# Altium schematic sheet M-LVDS_PHY.SchDoc: =ProjectName
size 420 x 297 mm; Author: T.P.; CompanyName: WUT; DrawnBy: T.P.; Organization: WUT ISE; Address1: Warsaw Univeristy of Technology; Address2: Nowowiejska 15/19; DocumentNumber: 32; Revision: 0.9; SheetNumber: 32; SheetTotal: 36; EDA_Number: ARTIQ; Projet: ARTIQ/SINARA; ModifiedBy: -; CreateDate: XX/XX/XXXX; CheckedDate: -; Title2: M-LVDS_PHY.SchDoc; DivGrp: ISE; Designer: G.K. and T.P.; ModifiedDate: -; ProjectName: ADC/DAC MEZZANINE
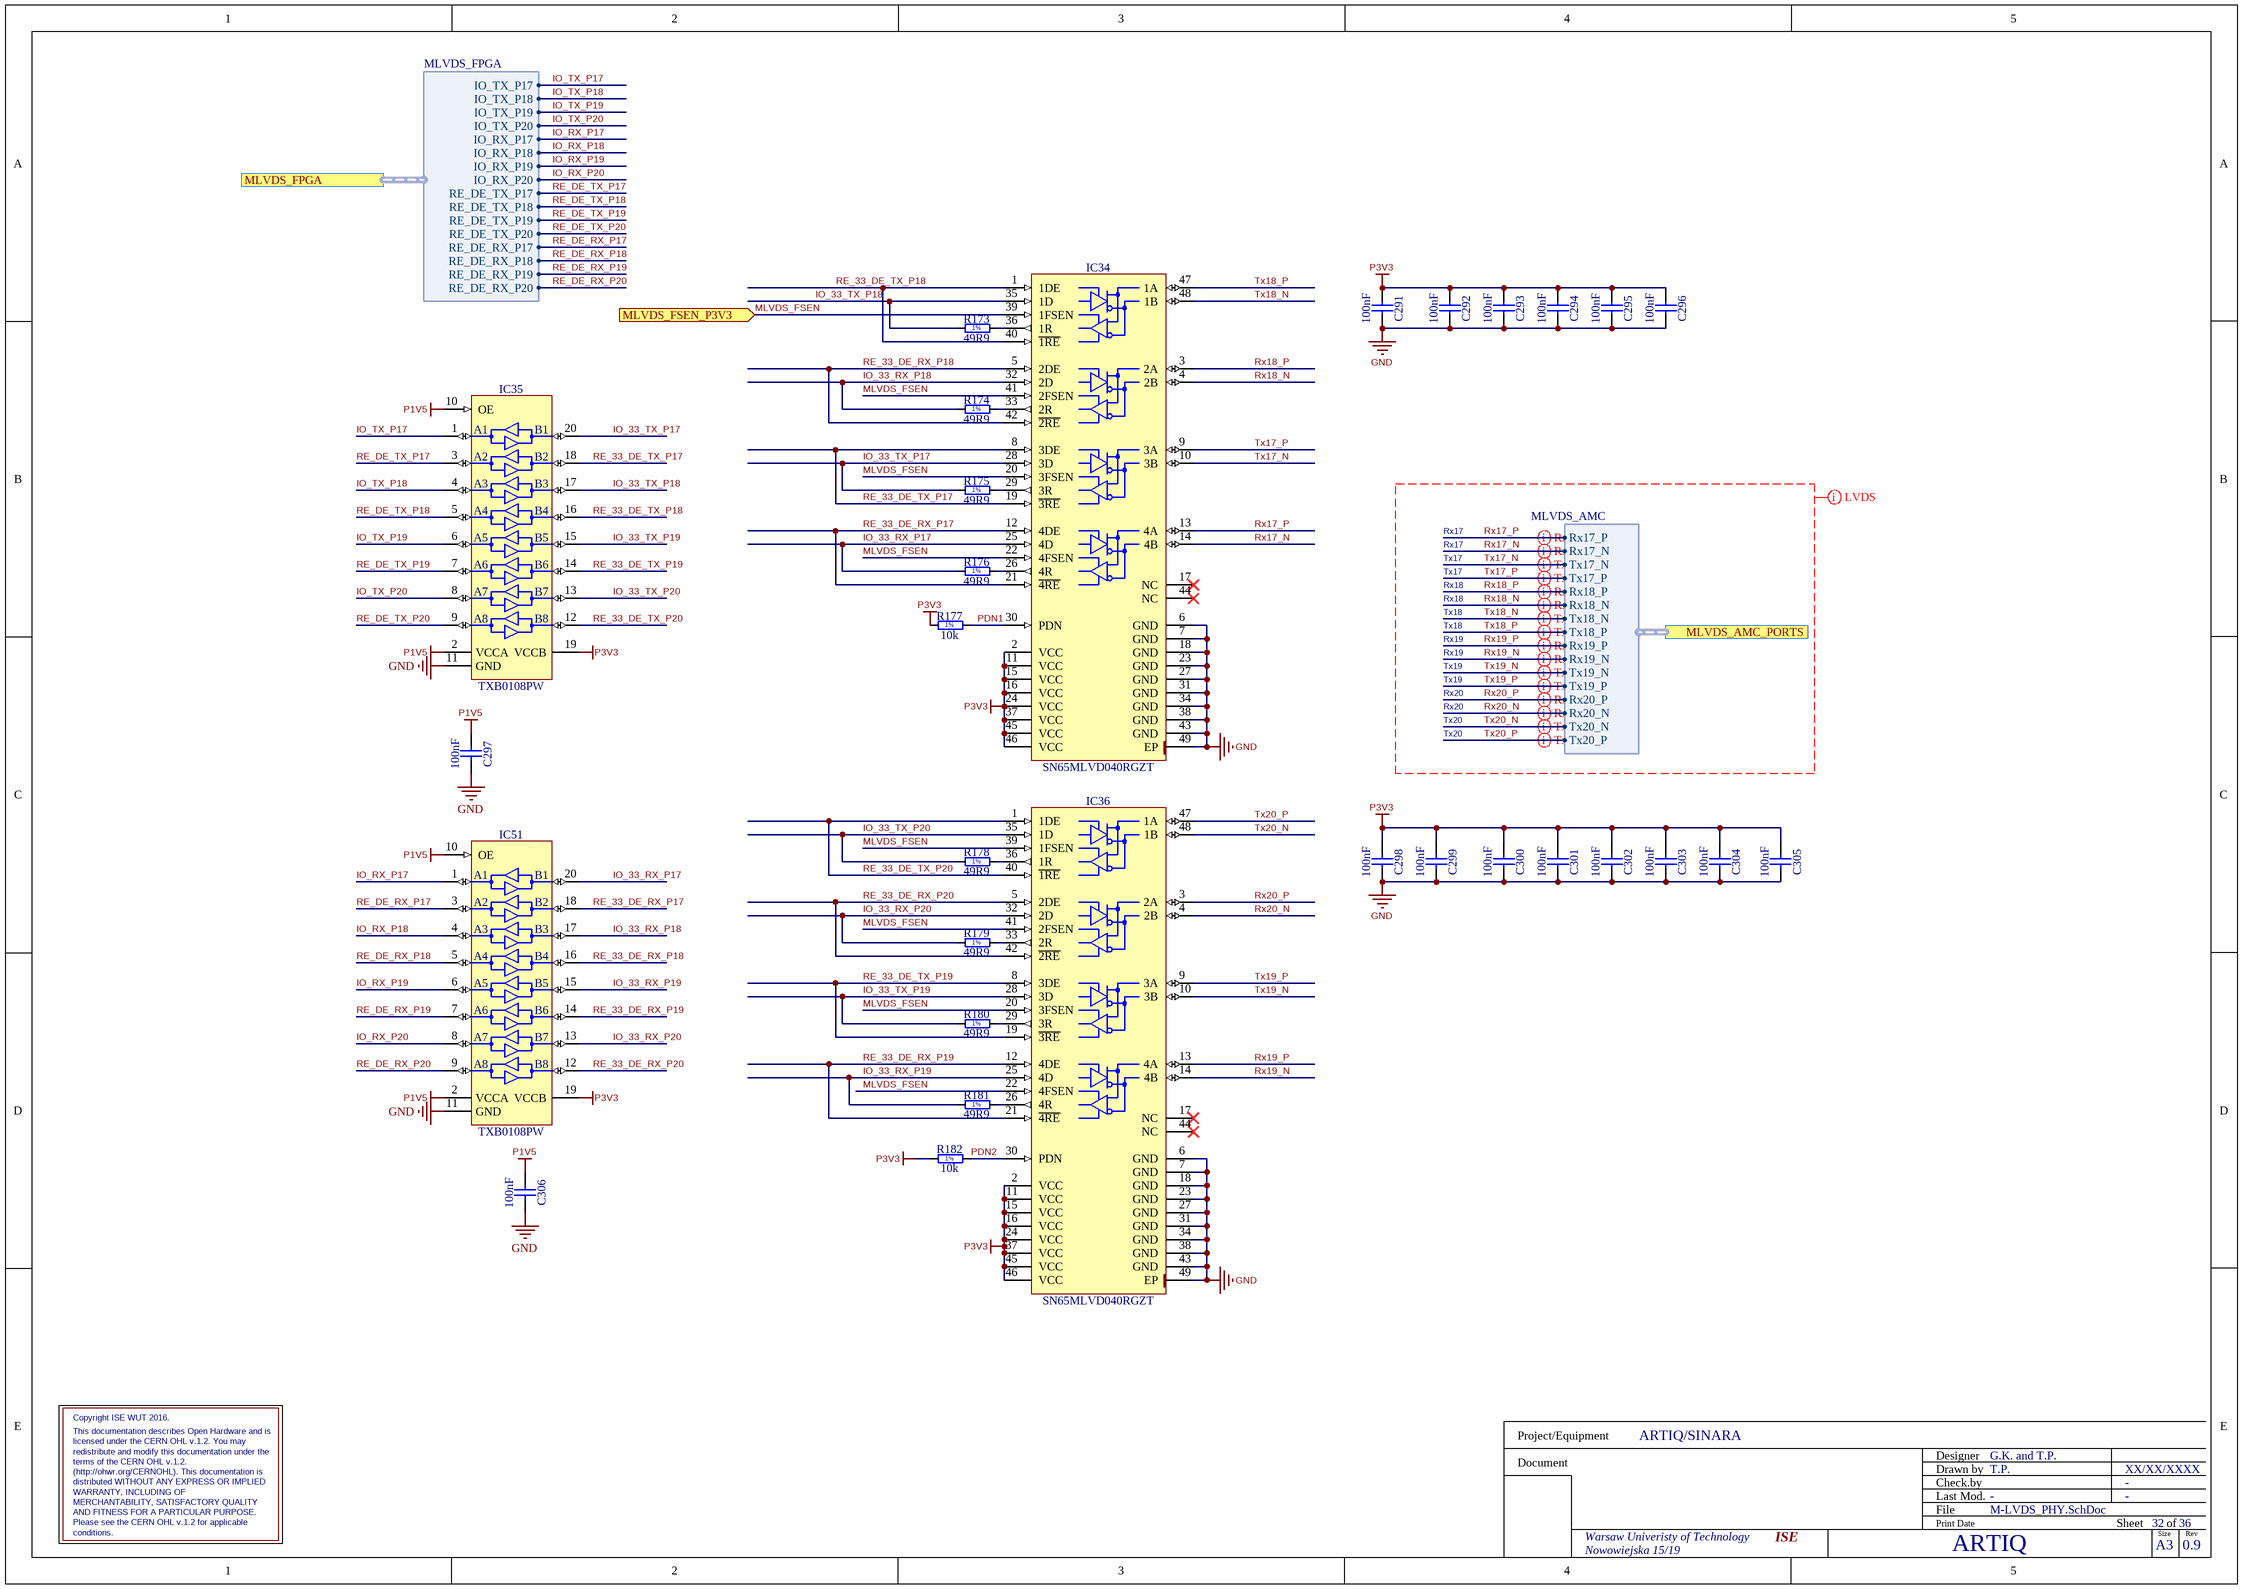
[diagram p0: M-LVDS_PHY.SchDoc]

## Parts
C291  100nF  [CAPC0603X33N]
C292  100nF  [CAPC0603X33N]
C293  100nF  [CAPC0603X33N]
C294  100nF  [CAPC0603X33N]
C295  100nF  [CAPC0603X33N]
C296  100nF  [CAPC0603X33N]
C297  100nF  [CAPC0603X33N]
C298  100nF  [CAPC0603X33N]
C299  100nF  [CAPC0603X33N]
C300  100nF  [CAPC0603X33N]
C301  100nF  [CAPC0603X33N]
C302  100nF  [CAPC0603X33N]
C303  100nF  [CAPC0603X33N]
C304  100nF  [CAPC0603X33N]
C305  100nF  [CAPC0603X33N]
C306  100nF  [CAPC0603X33N]
IC34  SN65MLVD040RGZT  [QFN50P700X700X100-49N-S420]
IC35  TXB0108PW  [SOP65P640X120-20N]
IC36  SN65MLVD040RGZT  [QFN50P700X700X100-49N-S420]
IC51  TXB0108PW  [SOP65P640X120-20N]
R173  49R9  [RESC1005X40N]
R174  49R9  [RESC1005X40N]
R175  49R9  [RESC1005X40N]
R176  49R9  [RESC1005X40N]
R177  10k  [RESC1005X40N]
R178  49R9  [RESC1005X40N]
R179  49R9  [RESC1005X40N]
R180  49R9  [RESC1005X40N]
R181  49R9  [RESC1005X40N]
R182  10k  [RESC1005X40N]

## Ports
MLVDS_AMC_PORTS (harness MLVDS_AMC), MLVDS_FPGA (harness MLVDS_FPGA), MLVDS_FSEN_P3V3 (in)

## Harnesses
MLVDS_AMC: Rx17_P, Rx17_N, Tx17_N, Tx17_P, Rx18_P, Rx18_N, Tx18_N, Tx18_P, Rx19_P, Rx19_N, Tx19_N, Tx19_P, Rx20_P, Rx20_N, Tx20_N, Tx20_P
MLVDS_FPGA: IO_TX_P17, IO_TX_P18, IO_TX_P19, IO_TX_P20, IO_RX_P17, IO_RX_P18, IO_RX_P19, IO_RX_P20, RE_DE_TX_P17, RE_DE_TX_P18, RE_DE_TX_P19, RE_DE_TX_P20, RE_DE_RX_P17, RE_DE_RX_P18, RE_DE_RX_P19, RE_DE_RX_P20

## Nets
GND: C291.2 C292.2 C293.2 C294.2 C295.2 C296.2 C297.2 C298.2 C299.2 C300.2 C301.2 C302.2 C303.2 C304.2 C305.2 C306.2 IC34.6(GND) IC34.7(GND) IC34.18(GND) IC34.23(GND) IC34.27(GND) IC34.31(GND) IC34.34(GND) IC34.38(GND) IC34.43(GND) IC34.49(EP) IC35.11(GND) IC36.6(GND) IC36.7(GND) IC36.18(GND) IC36.23(GND) IC36.27(GND) IC36.31(GND) IC36.34(GND) IC36.38(GND) IC36.43(GND) IC36.49(EP) IC51.11(GND)
P1V5: C297.1 C306.1 IC35.2(Vcca) IC35.10(OE) IC51.2(Vcca) IC51.10(OE)
P3V3: C291.1 C292.1 C293.1 C294.1 C295.1 C296.1 C298.1 C299.1 C300.1 C301.1 C302.1 C303.1 C304.1 C305.1 IC34.2(VCC) IC34.11(VCC) IC34.15(VCC) IC34.16(VCC) IC34.24(VCC) IC34.37(VCC) IC34.45(VCC) IC34.46(VCC) IC35.19(Vccb) IC36.2(VCC) IC36.11(VCC) IC36.15(VCC) IC36.16(VCC) IC36.24(VCC) IC36.37(VCC) IC36.45(VCC) IC36.46(VCC) IC51.19(Vccb) R177.1 R182.1
IO_33_RX_P17: IC34.25(4D) IC51.20(B1) R176.1
IO_33_RX_P18: IC34.32(2D) IC51.17(B3) R174.1
IO_33_RX_P19: IC36.25(4D) IC51.15(B5) R181.1
IO_33_RX_P20: IC36.32(2D) IC51.13(B7) R179.1
IO_33_TX_P17: IC34.28(3D) IC35.20(B1) R175.1
IO_33_TX_P18: IC34.35(1D) IC35.17(B3) R173.1
IO_33_TX_P19: IC35.15(B5) IC36.28(3D) R180.1
IO_33_TX_P20: IC35.13(B7) IC36.35(1D) R178.1
IO_RX_P17: IC51.1(A1) ; port MLVDS_FPGA.IO_RX_P17
IO_RX_P18: IC51.4(A3) ; port MLVDS_FPGA.IO_RX_P18
IO_RX_P19: IC51.6(A5) ; port MLVDS_FPGA.IO_RX_P19
IO_RX_P20: IC51.8(A7) ; port MLVDS_FPGA.IO_RX_P20
IO_TX_P17: IC35.1(A1) ; port MLVDS_FPGA.IO_TX_P17
IO_TX_P18: IC35.4(A3) ; port MLVDS_FPGA.IO_TX_P18
IO_TX_P19: IC35.6(A5) ; port MLVDS_FPGA.IO_TX_P19
IO_TX_P20: IC35.8(A7) ; port MLVDS_FPGA.IO_TX_P20
MLVDS_FSEN: IC34.20(3FSEN) IC34.22(4FSEN) IC34.39(1FSEN) IC34.41(2FSEN) IC36.20(3FSEN) IC36.22(4FSEN) IC36.39(1FSEN) IC36.41(2FSEN) ; port MLVDS_FSEN_P3V3
PDN1: IC34.30(PDN) R177.2
PDN2: IC36.30(PDN) R182.2
RE_33_DE_RX_P17: IC34.12(4DE) IC34.21(~{4RE}) IC51.18(B2)
RE_33_DE_RX_P18: IC34.5(2DE) IC34.42(~{2RE}) IC51.16(B4)
RE_33_DE_RX_P19: IC36.12(4DE) IC36.21(~{4RE}) IC51.14(B6)
RE_33_DE_RX_P20: IC36.5(2DE) IC36.42(~{2RE}) IC51.12(B8)
RE_33_DE_TX_P17: IC34.8(3DE) IC34.19(~{3RE}) IC35.18(B2)
RE_33_DE_TX_P18: IC34.1(1DE) IC34.40(~{1RE}) IC35.16(B4)
RE_33_DE_TX_P19: IC35.14(B6) IC36.8(3DE) IC36.19(~{3RE})
RE_33_DE_TX_P20: IC35.12(B8) IC36.1(1DE) IC36.40(~{1RE})
RE_DE_RX_P17: IC51.3(A2) ; port MLVDS_FPGA.RE_DE_RX_P17
RE_DE_RX_P18: IC51.5(A4) ; port MLVDS_FPGA.RE_DE_RX_P18
RE_DE_RX_P19: IC51.7(A6) ; port MLVDS_FPGA.RE_DE_RX_P19
RE_DE_RX_P20: IC51.9(A8) ; port MLVDS_FPGA.RE_DE_RX_P20
RE_DE_TX_P17: IC35.3(A2) ; port MLVDS_FPGA.RE_DE_TX_P17
RE_DE_TX_P18: IC35.5(A4) ; port MLVDS_FPGA.RE_DE_TX_P18
RE_DE_TX_P19: IC35.7(A6) ; port MLVDS_FPGA.RE_DE_TX_P19
RE_DE_TX_P20: IC35.9(A8) ; port MLVDS_FPGA.RE_DE_TX_P20
Rx17_N: IC34.14(4B) ; port MLVDS_AMC_PORTS.Rx17_N
Rx17_P: IC34.13(4A) ; port MLVDS_AMC_PORTS.Rx17_P
Rx18_N: IC34.4(2B) ; port MLVDS_AMC_PORTS.Rx18_N
Rx18_P: IC34.3(2A) ; port MLVDS_AMC_PORTS.Rx18_P
Rx19_N: IC36.14(4B) ; port MLVDS_AMC_PORTS.Rx19_N
Rx19_P: IC36.13(4A) ; port MLVDS_AMC_PORTS.Rx19_P
Rx20_N: IC36.4(2B) ; port MLVDS_AMC_PORTS.Rx20_N
Rx20_P: IC36.3(2A) ; port MLVDS_AMC_PORTS.Rx20_P
Tx17_N: IC34.10(3B) ; port MLVDS_AMC_PORTS.Tx17_N
Tx17_P: IC34.9(3A) ; port MLVDS_AMC_PORTS.Tx17_P
Tx18_N: IC34.48(1B) ; port MLVDS_AMC_PORTS.Tx18_N
Tx18_P: IC34.47(1A) ; port MLVDS_AMC_PORTS.Tx18_P
Tx19_N: IC36.10(3B) ; port MLVDS_AMC_PORTS.Tx19_N
Tx19_P: IC36.9(3A) ; port MLVDS_AMC_PORTS.Tx19_P
Tx20_N: IC36.48(1B) ; port MLVDS_AMC_PORTS.Tx20_N
Tx20_P: IC36.47(1A) ; port MLVDS_AMC_PORTS.Tx20_P
NetIC34_26: IC34.26(4R) R176.2
NetIC34_29: IC34.29(3R) R175.2
NetIC34_33: IC34.33(2R) R174.2
NetIC34_36: IC34.36(1R) R173.2
NetIC36_26: IC36.26(4R) R181.2
NetIC36_29: IC36.29(3R) R180.2
NetIC36_33: IC36.33(2R) R179.2
NetIC36_36: IC36.36(1R) R178.2

Not connected (* = marked no-connect by the designer): IC34 17(NC)* 44(NC)*; IC36 17(NC)* 44(NC)*

## Layout directives
differential pair: Rx17_N, Rx17_P, Rx18_N, Rx18_P, Rx19_N, Rx19_P, Rx20_N, Rx20_P, Tx17_N, Tx17_P, Tx18_N, Tx18_P, Tx19_N, Tx19_P, Tx20_N, Tx20_P
mark named LVDS: Rx17_N, Rx17_P, Rx18_N, Rx18_P, Rx19_N, Rx19_P, Rx20_N, Rx20_P, Tx17_N, Tx17_P, Tx18_N, Tx18_P, Tx19_N, Tx19_P, Tx20_N, Tx20_P

## Notes on the sheet
- Rx17
- Tx17
- Rx18
- Tx19
- Tx18
- Rx19
- Tx20
- Rx20
- Copyright ISE WUT 2016.
- distributed WITHOUT ANY EXPRESS OR IMPLIED
- (http://ohwr.org/CERNOHL). This documentation is
- redistribute and modify this documentation under the
- terms of the CERN OHL v.1.2.
- licensed under the CERN OHL v.1.2. You may
- This documentation describes Open Hardware and is
- AND FITNESS FOR A PARTICULAR PURPOSE.
- MERCHANTABILITY, SATISFACTORY QUALITY
- Please see the CERN OHL v.1.2 for applicable
- conditions.
- WARRANTY, INCLUDING OF
- Project/Equipment
- Document
- Designer
- Drawn by
- Check.by
- File
- Last Mod.
- Print Date
- Sheet
- Size
- A3
- of
- Rev
- (in symbol R0402_10K_1%_0.0625W_100PPM) 1%
- (in symbol R0402_49R9_1%_0.0625W_100PPM) 1%
- (in symbol TXB0108PW) VCCA; VCCB

## Library data of the parts
C291-C306 = CC0201_100NF_6.3V_10%_X5R: Non-polarised capacitor; Manufacturer: GENERIC; Manufacturer1 Part Number: 02016D104KAT2A; Part Description: SMD Multilayer Chip Ceramic Capacitor; TC: X5R; Tolerance: ±10%; Voltage: 6.3V; Author: CERN DEM JLC; Case: 0201; Component Kind: Standard; Component Type: Standard; CreateDate: 03.12.2007; HelpURL: \\cern.ch\dfs\Applications\Altium\Datasheets\CC0201_X5R_AVX.pdf; LatestRevisionDate: 03.12.2007; Manufacturer Part Number: CC0201_100NF_6.3V_10%_X5R; Manufacturer1 ComponentHeight: 0.33mm; Manufacturer1 Example: AVX; Mounted: Yes; Part Number: CC0201_100NF_6.3V_10%_X5R; Pin Count: 2; SMD: Yes; Socket: No; Status: Not Recommended; Value: 100nF; Sense: No
IC34 IC36 = SN65MLVD040RGZT: 4-Channel Half-Duplex M-LVDS Line Transceiver; Manufacturer: TEXAS INSTRUMENTS; PressFit: No; Bonding: No; Part Number: SN65MLVD040RGZT; Component Kind: Standard; Component Type: Standard; Device: SN65MLVD040RGZT; PackageDescription: QFN, 0.50mm Pitch, Square; 48 Pin, 7.00mm L X 7.00mm W X 1mm H body (W/Thermal Tab 4.2mm X 4.2mm), IPC Medium Density; Part Description: 4-Channel Half-Duplex M-LVDS Line Transceiver; Manufacturer Part Number: SN65MLVD040RGZT; Pin Count: 49; Case: QFN48; Mounted: Yes; Socket: No; SMD: Yes; Sense: No; ComponentHeight: 1mm; Author: CERN DEM JLC; HelpURL: \\cern.ch\dfs\Applications\Altium\Datasheets\SN65MLVD040RGZT.pdf; CreateDate: 17.03.2011; LatestRevisionDate: 17.03.2011
IC35 IC51 = TXB0108PW: 8-Bit Bidirectional Voltage-Level Translator with Automatic Direction Sensing and ±15kV ESD Protection; Manufacturer: TEXAS INSTRUMENTS; PressFit: No; Bonding: No; Part Number: TXB0108PW; Component Kind: Standard; Component Type: Standard; Device: TXB0108PW; PackageDescription: SOP, 20-Leads, Body 6.5x4.4mm, Pitch 0.65mm, IPC Medium Density; Part Description: 8-Bit Bidirectional Voltage-Level Translator with Automatic Direction Sensing and ±15kV ESD Protection; Manufacturer Part Number: TXB0108PW; Pin Count: 20; Case: TSSOP20; Mounted: Yes; Socket: No; SMD: Yes; Sense: No; ComponentHeight: 1.2mm; Author: CERN DEM MR; HelpURL: \\cern.ch\dfs\Applications\Altium\Datasheets\TXB0108PW.pdf; CreateDate: 01.04.2016; LatestRevisionDate: 01.04.2016
R173-R176 R178-R181 = R0402_49R9_1%_0.0625W_100PPM: Resistor - 1%; Manufacturer: GENERIC; Manufacturer1 Part Number: 232270674999L or RC0402FR-0749R9L; Part Description: General Purpose Thick Film Chip Resistor; TC: ±100ppm/°C; PressFit: No; Author: CERN DEM JLC; Case: 0402; Component Kind: Standard; Component Type: Standard; CreateDate: 24.10.2012; HelpURL: \\cern.ch\dfs\Applications\Altium\Datasheets\R0402_Phycomp_RC0402.pdf; LatestRevisionDate: 24.10.2012; Manufacturer Part Number: R0402_49R9_1%_0.0625W_100PPM; Manufacturer1 ComponentHeight: 0.4mm; Manufacturer1 Example: YAGEO PHYCOMP; Mounted: Yes; Part Number: R0402_49R9_1%_0.0625W_100PPM; Pin Count: 2; Power: 0.0625W; SMD: Yes; Socket: No; Status: Not Recommended; Tolerance: ±1%; Value: 49R9; Sense: No
R177 R182 = R0402_10K_1%_0.0625W_100PPM: Resistor - 1%; Manufacturer: GENERIC; Manufacturer1 Part Number: 232270671003L; Part Description: General Purpose Thick Film Chip Resistor; TC: ±100ppm/°C; PressFit: No; Author: CERN DEM JLC; Case: 0402; Component Kind: Standard; Component Type: Standard; CreateDate: 03.12.2007; HelpURL: \\cern.ch\dfs\Applications\Altium\Datasheets\R0402_Phycomp_RC0402.pdf; LatestRevisionDate: 17.10.2012; Manufacturer Part Number: R0402_10K_1%_0.0625W_100PPM; Manufacturer1 ComponentHeight: 0.4mm; Manufacturer1 Example: YAGEO PHYCOMP; Mounted: Yes; Part Number: R0402_10K_1%_0.0625W_100PPM; Pin Count: 2; Power: 0.0625W; SMD: Yes; Socket: No; Status: Not Recommended; Tolerance: ±1%; Value: 10k; Sense: No